# Altium project R100.230.040.000-00 Filtr1.PrjPcb
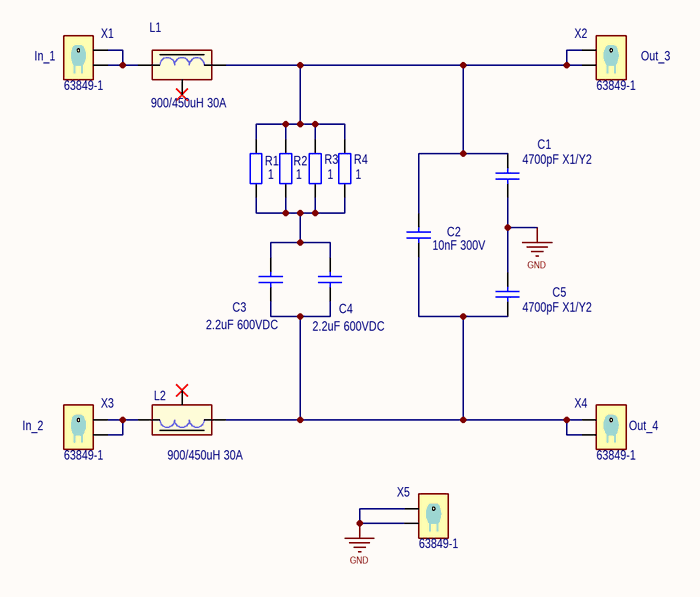
[diagram p0: Filtr1.SchDoc]
1 sheet, 16 parts. Net scope: global (net labels, ports and power ports of the same name join across sheets).
Board file: R100.230.040.001-00 Filtr1.PcbDoc

## Sheet Filtr1.SchDoc
size A4; Organization: OLTEST; Revision: 01; SheetNumber: 1; SheetTotal: 1; Файл: SourceBoard_v1; Разработчик: Бондарчук С.; Прибор: R100; АМАК.000000.000 Э3: R100.230.040.000-00; Дата: 15.04.2019; Формат: A4; PageSetup: Record=PageOptions|CenterHorizontal=True|CenterVertical=True|PrintScale=0.97|XCorrection=1.00|YCorrection=1.00|PrintKind=1|BorderSize=5000000|LeftOffset=0|BottomOffset=0|Orientation=2|PaperLength=2970|PaperWidth=2100|Scale=100|PaperSource=7|PrintQuality=600|MediaType=1|DitherType=10|PrintScaleMode=1|PaperKind=A4|PaperIndex=9; WorkspaceName: R100_Boards_v1

### Parts
C1  4700pF X1/Y2  [SMD_C_2220]
C2  10nF 300V  [C Y2 D13 7.5b]
C3  2.2uF 600VDC  [MKP_W20_H39.5_L41.5_LS37.5]
C4  2.2uF 600VDC  [MKP_W20_H39.5_L41.5_LS37.5]
C5  4700pF X1/Y2  [SMD_C_2220]
L1  900/450uH 30A  [Dross (900/450 uH) R100230.041.000]
L2  900/450uH 30A  [Dross (900/450 uH) R100230.041.000]
R1  1  [PRW 5W vertical]
R2  1  [PRW 5W vertical]
R3  1  [PRW 5W vertical]
R4  1  [PRW 5W vertical]
X1  63849-1  [63849-1]
X2  63849-1  [63849-1]
X3  63849-1  [63849-1]
X4  63849-1  [63849-1]
X5  63849-1  [63849-1]

### Nets
GND: C1.1 C5.2 X5.1 X5.2
NetC1_2: C1.2 C2.2 L1.2 R1.1 R2.1 R3.1 R4.1 X2.1 X2.2
NetC2_1: C2.1 C3.2 C4.1 C5.1 L2.2 X4.1 X4.2
NetC3_1: C3.1 C4.2 R1.2 R2.2 R3.2 R4.2
NetL1_1: L1.1 X1.1 X1.2
NetL2_1: L2.1 X3.1 X3.2

Not connected (* = marked no-connect by the designer): L1 3*; L2 3*

### Notes on the sheet
- (near X1) In_1
- (near X2) Out_3
- (near X3) In_2
- (near X4) Out_4
- Разработчик:
- Формат:
- Rev.:
- Лист
- Дата:
- Листов
- WorkSpace:
- Дата изм.:

### Library data of the parts
C1 C5 = C X1Y2 4700pF SMD 2220 250Vac 10%: SMD C2220 MURATA 250Vac 10% X7R X1Y2; PartNumber: GA355DR7GF472kW01; Manufacturer: MURATA; Value: 4700pF X1/Y2
C2 = C X1Y2 10nF D13 LS7.5: Ceramic D=14 LS=7.5 300VAC X1Y2; PartNumber: DE2F3KY103MA3; Manufacturer: Murata; Value: 10nF 300V
C3 C4 = MKP1 2.2uF 10% 600VDC: Polypropelene W20 H39.5 L41.5 LS37.5 600VDC 10%; PartNumber: MKP1J042207G00K; Manufacturer: Wima; Value: 2.2uF 600VDC
L1 L2 = Dross 900/450uH 30A R100.230.041.000: 900/450uH 30A  (Core CK40090 X2); Manufacturer: OLTEST; PartNumber: R100.230.041.000; Value: 900/450uH 30A
R1-R4 = PRW 1 5W +-5%_1: Выводной PRW 5W 1R +-5%; PartNumber: PRW05WJW10J; Manufacturer: RoyalOhm; Value: 0.27
X1-X5 = 63849-1: PCB, 6.3х0.8, hole; Manufacturer: TE Connectivity; PartNumber: 63849-1